# EAGLE design sang_bu (EAGLE 6.0)
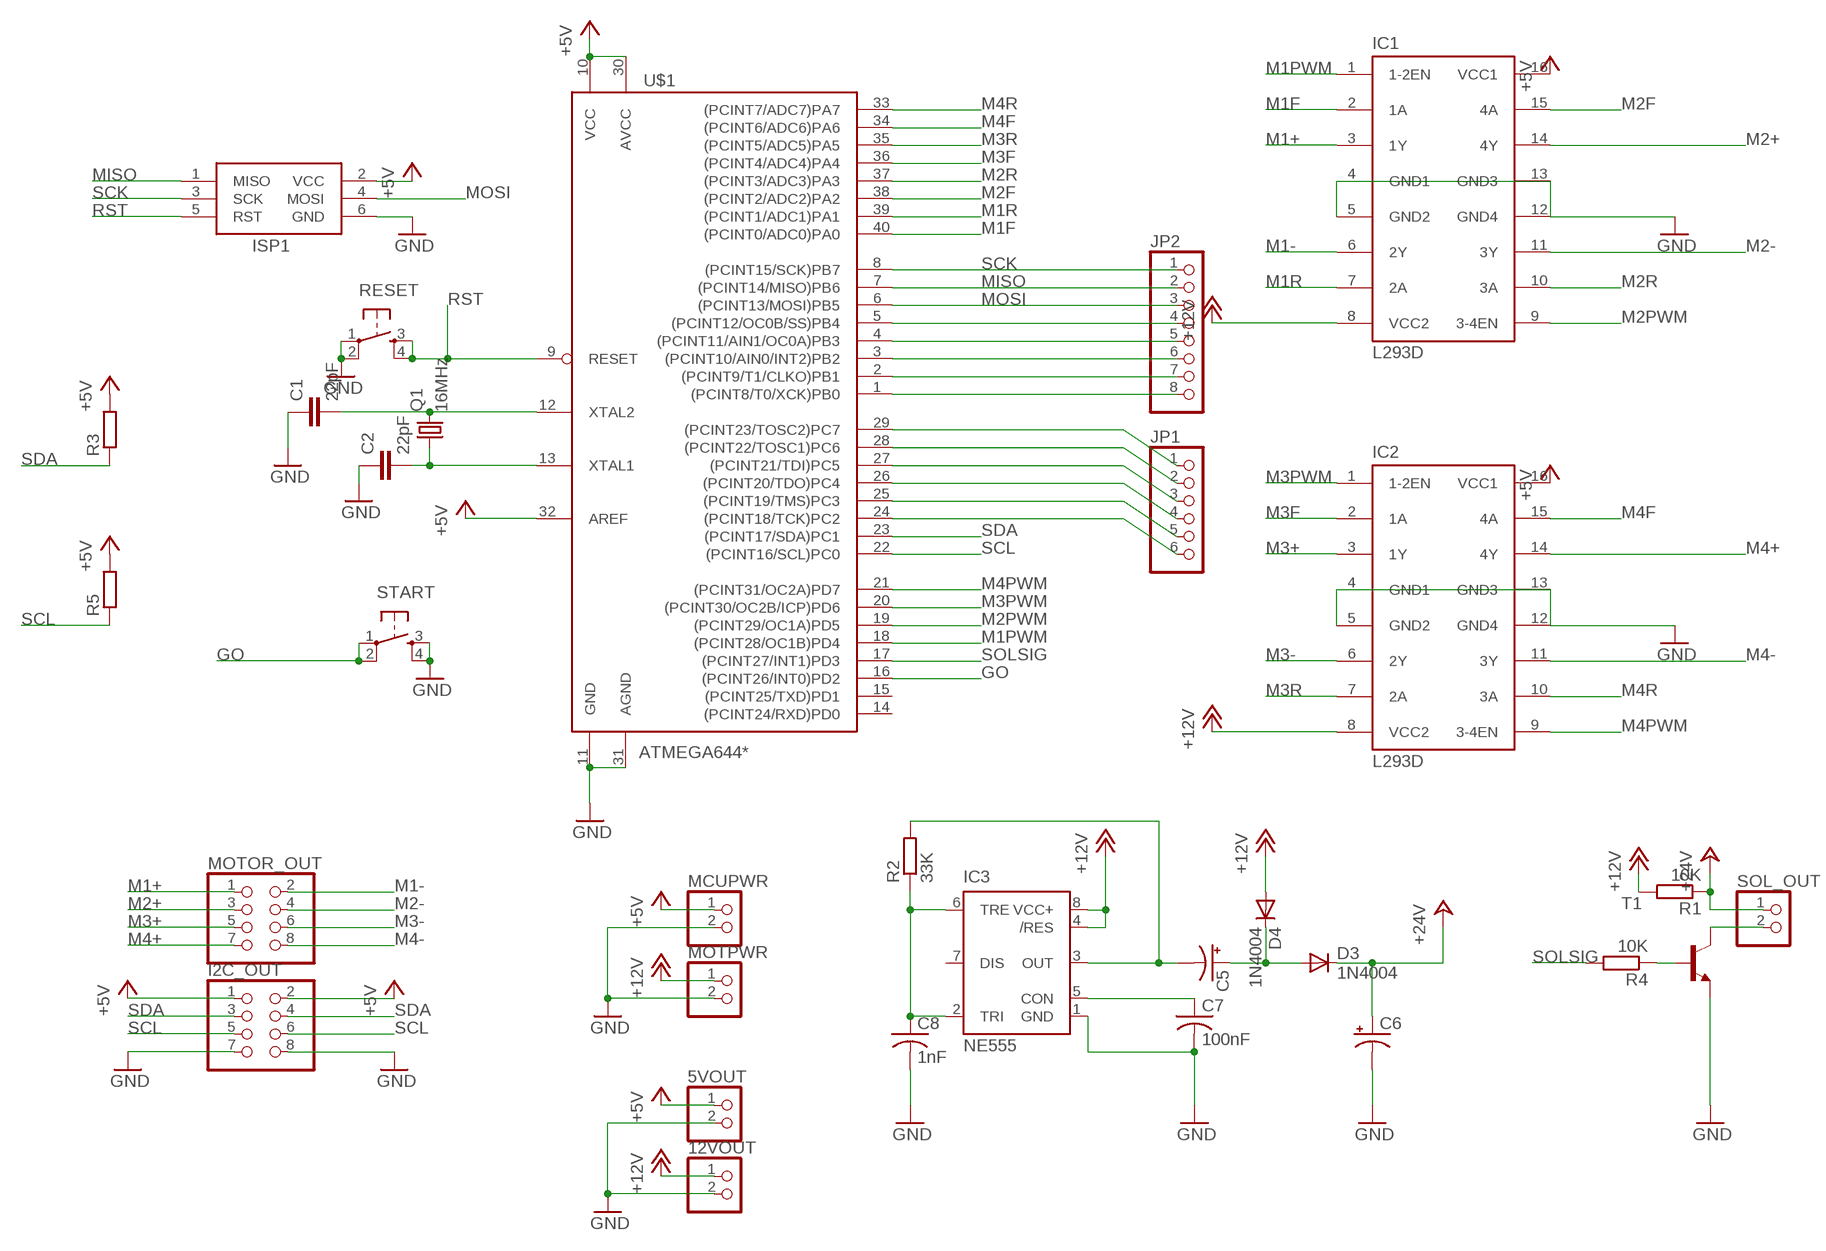
[diagram p0: schematic, sheet 1]

## Parts
5VOUT  PINHD-1X2  [1X02]
12VOUT  PINHD-1X2  [1X02]
C1  22pF  C2.5/2  [C2.5-2]
C2  22pF  C2.5/2  [C2.5-2]
C5  CPOL-USE7.5-18  [E7,5-18]
C6  CPOL-USE7.5-18  [E7,5-18]
C7  100nF  C-US025-030X050  [C025-030X050]
C8  1nF  C-US025-030X050  [C025-030X050]
D3  1N4004  [DO41-10]
D4  1N4004  [DO41-10]
I2C_OUT  PINHD-2X4  [2X04]
IC1  L293D  [DIL16]
IC2  L293D  [DIL16]
IC3  NE555  [DIL-08]
ISP1  AVRISP-6  [AVRISP]
JP1  PINHD-1X6  [1X06]
JP2  PINHD-1X8BIG  [1X08-BIG]
MCUPWR  PINHD-1X2  [1X02]
MOTOR_OUT  PINHD-2X4  [2X04]
MOTPWR  PINHD-1X2  [1X02]
Q1  16MHz  CRYSTALHC49U70  [HC49U70]
R1  10K  R-EU_0207/10  [0207/10]
R2  33K  R-EU_0207/10  [0207/10]
R3  R-EU_0204/7  [0204/7]
R4  10K  R-EU_0207/10  [0207/10]
R5  R-EU_0204/7  [0204/7]
RESET  TAC_SWITCHPTH  [TACTILE-PTH]
SOL_OUT  PINHD-1X2  [1X02]
START  TAC_SWITCHPTH  [TACTILE-PTH]
T1  2N2218-NPN-TO39-EBC  [TO39]
U$1  ATMEGA644*  [ATMEGA644]

## Nets
+5V [LowPow]: 5VOUT.1 I2C_OUT.1 I2C_OUT.2 IC1.16(VCC1) IC2.16(VCC1) ISP1.2(VCC) MCUPWR.1 R3.2 R5.2 U$1.10(VCC) U$1.30(AVCC) U$1.32(AREF)
+12V [HighPow]: 12VOUT.1 D4.A IC1.8(VCC2) IC2.8(VCC2) IC3.4(/RES) IC3.8(VCC+) MOTPWR.1 R1.2
+24V [HighPow]: C6.+ D3.C R1.1 SOL_OUT.1
GND [HighPow]: 5VOUT.2 12VOUT.2 C1.1 C2.1 C6.- C7.2 C8.2 I2C_OUT.7 I2C_OUT.8 IC1.4(GND1) IC1.5(GND2) IC1.12(GND4) IC1.13(GND3) IC2.4(GND1) IC2.5(GND2) IC2.12(GND4) IC2.13(GND3) IC3.1(GND) ISP1.6(GND) MCUPWR.2 MOTPWR.2 RESET.1 RESET.2 START.3 START.4 T1.1(E) U$1.11(GND) U$1.31(AGND)
GO: START.1 START.2 U$1.16((PCINT26/INT0)PD2)
M1+ [HighPow]: IC1.3(1Y) MOTOR_OUT.1
M1- [HighPow]: IC1.6(2Y) MOTOR_OUT.2
M1F: IC1.2(1A) U$1.40((PCINT0/ADC0)PA0)
M1PWM: IC1.1(1-2EN) U$1.18((PCINT28/OC1B)PD4)
M1R: IC1.7(2A) U$1.39((PCINT1/ADC1)PA1)
M2+: IC1.14(4Y) MOTOR_OUT.3
M2- [HighPow]: IC1.11(3Y) MOTOR_OUT.4
M2F: IC1.15(4A) U$1.38((PCINT2/ADC2)PA2)
M2PWM: IC1.9(3-4EN) U$1.19((PCINT29/OC1A)PD5)
M2R: IC1.10(3A) U$1.37((PCINT3/ADC3)PA3)
M3+ [HighPow]: IC2.3(1Y) MOTOR_OUT.5
M3- [HighPow]: IC2.6(2Y) MOTOR_OUT.6
M3F: IC2.2(1A) U$1.36((PCINT4/ADC4)PA4)
M3PWM: IC2.1(1-2EN) U$1.20((PCINT30/OC2B/ICP)PD6)
M3R: IC2.7(2A) U$1.35((PCINT5/ADC5)PA5)
M4+ [HighPow]: IC2.14(4Y) MOTOR_OUT.7
M4- [HighPow]: IC2.11(3Y) MOTOR_OUT.8
M4F: IC2.15(4A) U$1.34((PCINT6/ADC6)PA6)
M4PWM: IC2.9(3-4EN) U$1.21((PCINT31/OC2A)PD7)
M4R: IC2.10(3A) U$1.33((PCINT7/ADC7)PA7)
MISO [LowPow]: ISP1.1(MISO) JP2.2 U$1.7((PCINT14/MISO)PB6)
MOSI [LowPow]: ISP1.4(MOSI) JP2.3 U$1.6((PCINT13/MOSI)PB5)
N$1: C1.2 Q1.2 U$1.12(XTAL2)
N$2: C2.2 Q1.1 U$1.13(XTAL1)
N$3: C8.1 IC3.2(TRI) IC3.6(TRE) R2.1
N$4: R4.1 T1.2(B)
N$5: C5.- IC3.3(OUT) R2.2
N$6 [HighPow]: C5.+ D3.A D4.C
N$7: SOL_OUT.2 T1.3(C)
N$8: JP1.6 U$1.24((PCINT18/TCK)PC2)
N$9: C7.1 IC3.5(CON)
N$10: JP1.5 U$1.25((PCINT19/TMS)PC3)
N$11: JP1.4 U$1.26((PCINT20/TDO)PC4)
N$12: JP1.3 U$1.27((PCINT21/TDI)PC5)
N$13: JP1.2 U$1.28((PCINT22/TOSC1)PC6)
N$14: JP1.1 U$1.29((PCINT23/TOSC2)PC7)
N$15: JP2.8 U$1.1((PCINT8/T0/XCK)PB0)
N$16: JP2.7 U$1.2((PCINT9/T1/CLKO)PB1)
N$17: JP2.6 U$1.3((PCINT10/AIN0/INT2)PB2)
N$18: JP2.5 U$1.4((PCINT11/AIN1/OC0A)PB3)
N$19: JP2.4 U$1.5((PCINT12/OC0B/SS)PB4)
RST [LowPow]: ISP1.5(RST) RESET.3 RESET.4 U$1.9(RESET)
SCK [LowPow]: ISP1.3(SCK) JP2.1 U$1.8((PCINT15/SCK)PB7)
SCL: I2C_OUT.5 I2C_OUT.6 R5.1 U$1.22((PCINT16/SCL)PC0)
SDA: I2C_OUT.3 I2C_OUT.4 R3.1 U$1.23((PCINT17/SDA)PC1)
SOLSIG: R4.2 U$1.17((PCINT27/INT1)PD3)
Unconnected: IC3.7(DIS) U$1.14((PCINT24/RXD)PD0) U$1.15((PCINT25/TXD)PD1)

## Library data of the parts
5VOUT 12VOUT MCUPWR MOTPWR SOL_OUT = pinhead:PINHD-1X2: PIN HEADER
C1 C2 = capacitor-wima:C: CAPACITOR naming: grid - package width
C5 C6 = adafruit:CPOL-US: POLARIZED CAPACITOR, American symbol
C7 C8 = adafruit:C-US: CAPACITOR, American symbol
D3 D4 = adafruit:1N4004: DIODE General purpose 1N400x type rectifier (With bigger pads) http://www.ladyada.net/library/pcb/eaglelibrary.html
I2C_OUT MOTOR_OUT = pinhead:PINHD-2X4: PIN HEADER
IC1 IC2 = st-microelectronics:L293D: PUSH-PULL 4 CHANNEL DRIVER; MPN: L293D; OC_FARNELL: 9589619; OC_NEWARK: 56P8249
IC3 = st-microelectronics:NE555: General purpose bipolar Timer; MF: Arrow Electronics; MPN: NE555N; OC_FARNELL: 1467742; OC_NEWARK: 89K1486
ISP1 = adafruit:AVRISP: AVR ISP HEADER Standard 6 pin header for AVR programming
JP1 = adafruit:PINHD-1X6: PIN HEADER
JP2 = adafruit:PINHD-1X8: PIN HEADER
Q1 = crystal:CRYSTAL: CRYSTAL; OC_FARNELL: unknown; OC_NEWARK: unknown
R1 R3-R5 = resistor:R-EU_: RESISTOR, European symbol
R2 = rcl:R-EU_: RESISTOR, European symbol
RESET START = SparkFun:TAC_SWITCH: Momentary Switch Button commonly used for reset or general input. Spark Fun Electronics SKU : COM-00097
T1 = transistor:*-NPN-: NPN Transistror BF959 corrected 2008.03.06
U$1 = ATMega644:ATMEGA644

## Net classes
0 default: width 0.254 mm, drill 0.254 mm
1 HighPow: width 1.27 mm, drill 1.27 mm
2 LowPow: width 0.254 mm, drill 0.254 mm

## Board
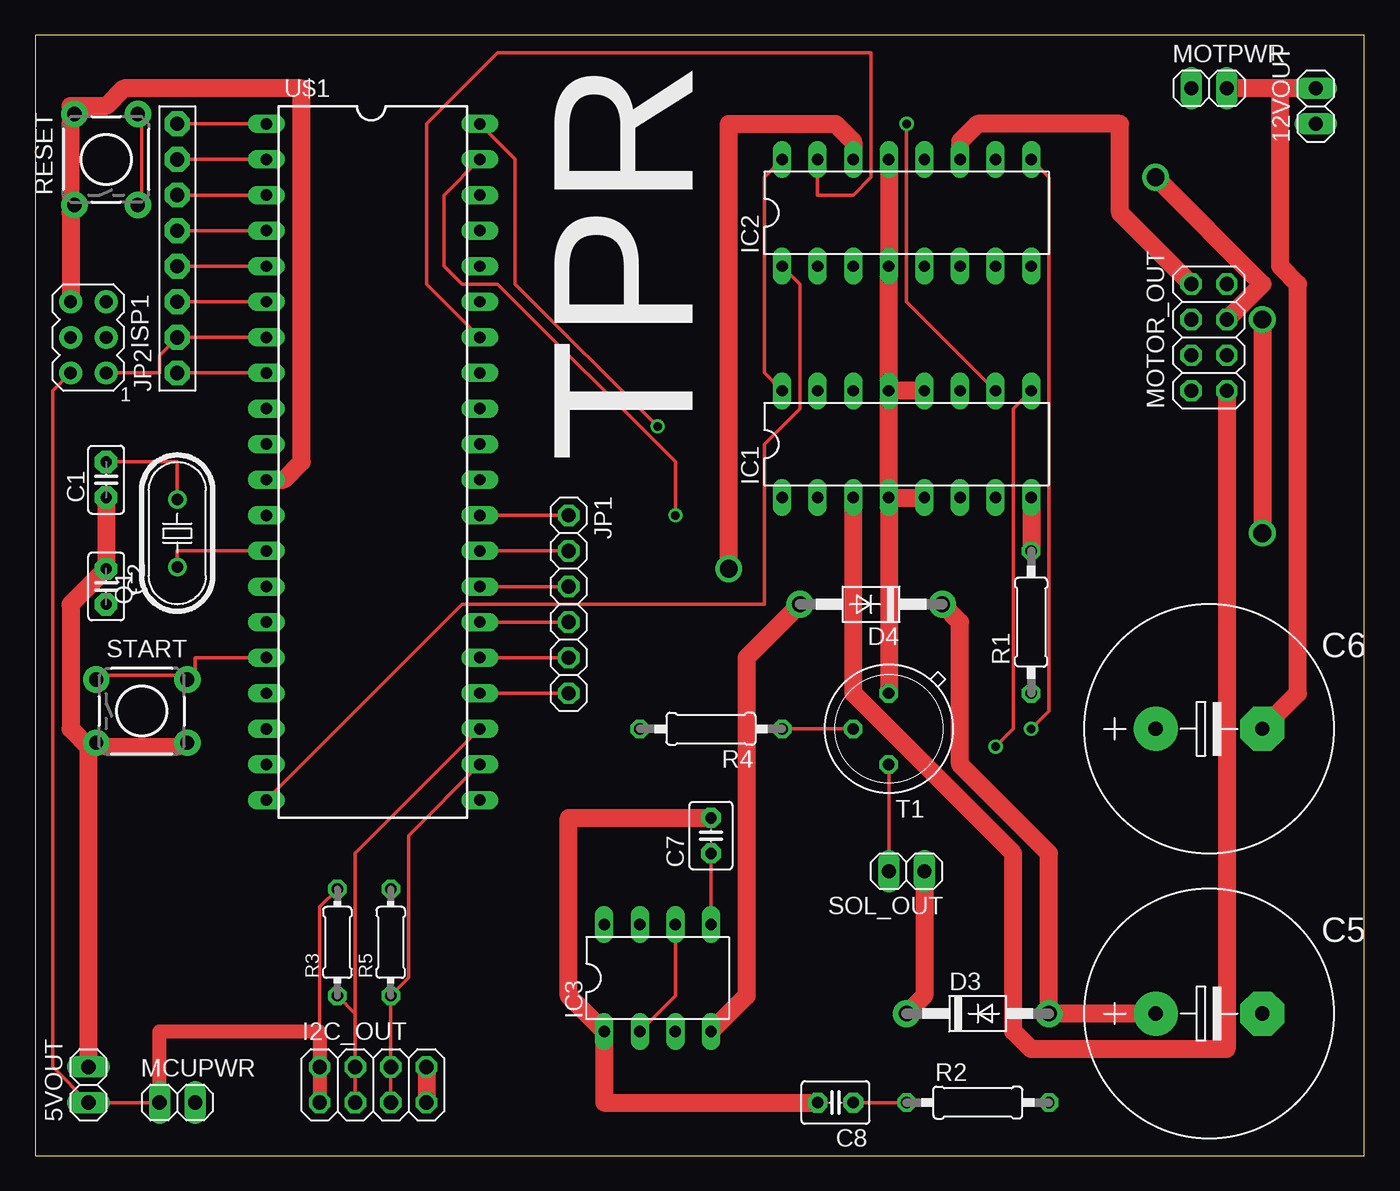
[diagram p1: board, top side]
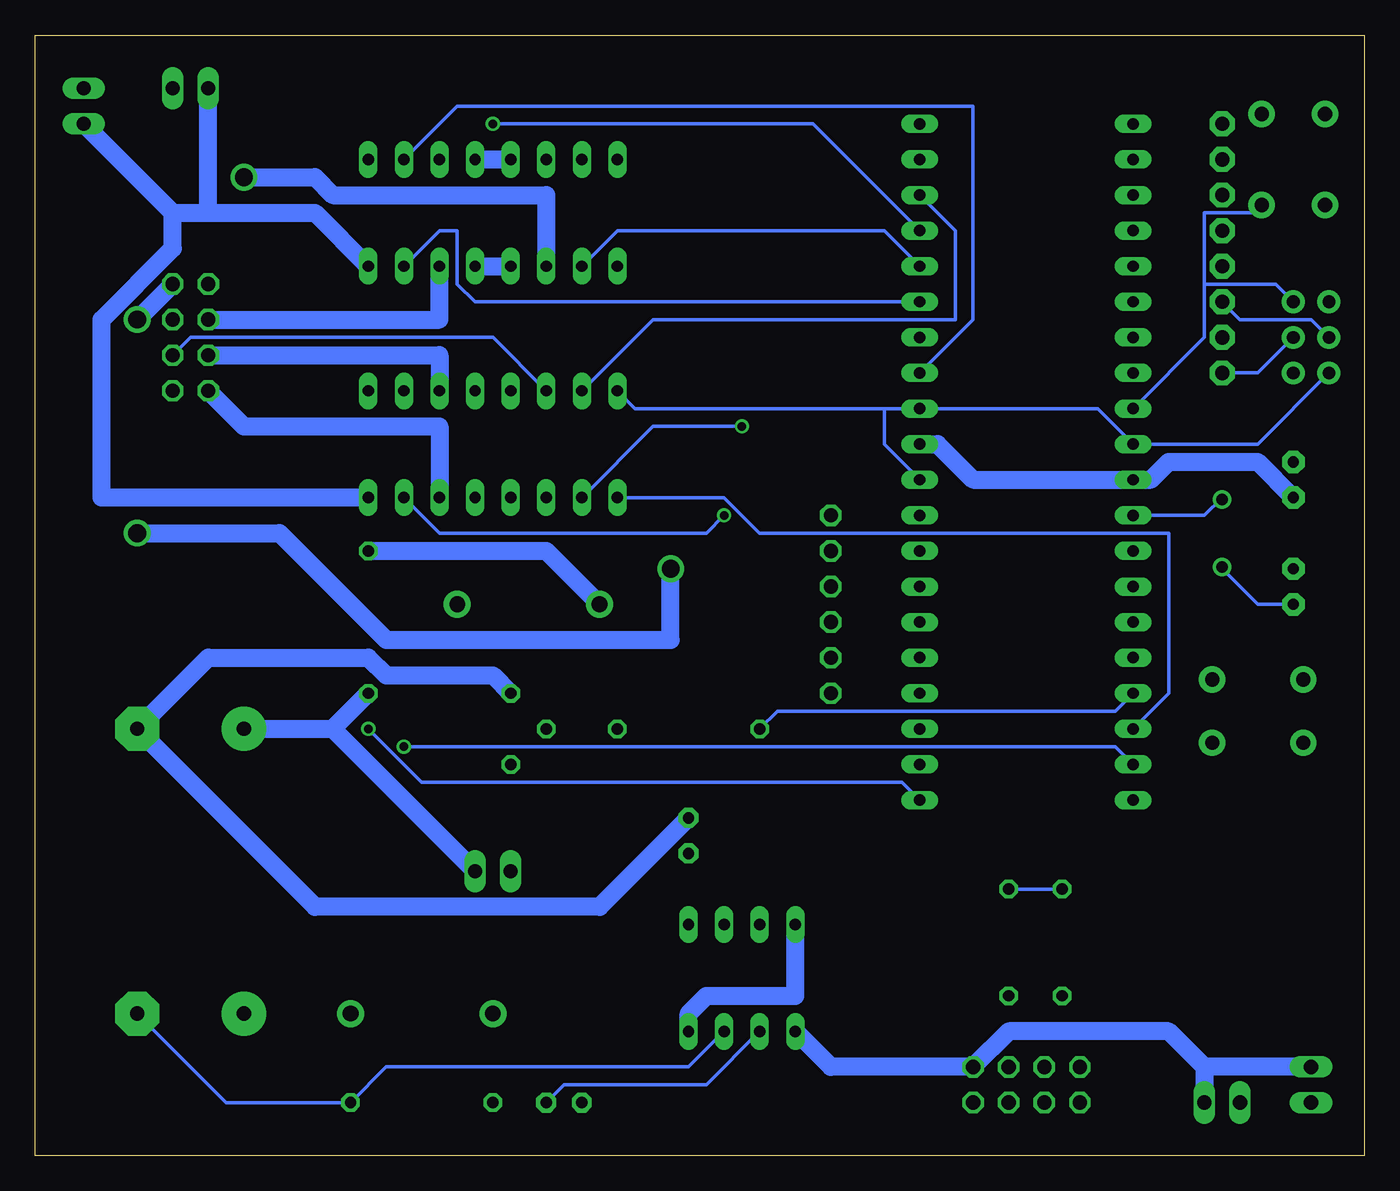
[diagram p2: board, bottom side, seen from below]

Size 94.92 x 80 mm. Coordinates in mm from the lower left corner, seen from the top.
Outline: 0,0 94.92,0 94.92,80 0,80 0,0
Copper layers (1*16): Top 0.035mm / dielectric 1.5mm / Bottom 0.035mm
Design rules: minimum track width 10mil, minimum drill 24mil, track to track 8mil, track to pad 8mil, pad to pad 8mil, via to via 8mil, smd to smd 8mil, copper to edge 40mil, drill to drill 8mil, minimum pad ring 10mil, minimum via ring 8mil, stop-mask expansion 4mil, vias tented up to drill 0mil, thermal gap 10mil

### Footprints (pad centres in the part's own frame; a part is rotated, then mirrored left to right if it is on the bottom)
1X02 = drill 1.016 long: 1 -1.27,0; 2 1.27,0
C2.5-2 = drill 0.813 pad 1.6 octagon: 1 -1.27,0; 2 1.27,0
E7,5-18 = drill 1.016 pad 3.15: + -3.81,0 | drill 1.016 pad 3.15 octagon: - 3.81,0
C025-030X050 = drill 0.813 pad 1.422 octagon: 1 -1.27,0; 2 1.27,0
DO41-10 = drill 1.118 pad 1.93: A 5.08,0; C -5.08,0
2X04 = drill 1.016 octagon: 1 -3.81,-1.27; 2 -3.81,1.27; 3 -1.27,-1.27; 4 -1.27,1.27; 5 1.27,-1.27; 6 1.27,1.27; 7 3.81,-1.27; 8 3.81,1.27
DIL16 = drill 0.813 long: 1 -8.89,-3.81; 2 -6.35,-3.81; 3 -3.81,-3.81; 4 -1.27,-3.81; 5 1.27,-3.81; 6 3.81,-3.81; 7 6.35,-3.81; 8 8.89,-3.81; 9 8.89,3.81; 10 6.35,3.81; 11 3.81,3.81; 12 1.27,3.81; 13 -1.27,3.81; 14 -3.81,3.81; 15 -6.35,3.81; 16 -8.89,3.81
DIL-08 = drill 0.813 long: 1 -3.81,-3.81; 2 -1.27,-3.81; 3 1.27,-3.81; 4 3.81,-3.81; 5 3.81,3.81; 6 1.27,3.81; 7 -1.27,3.81; 8 -3.81,3.81
AVRISP = drill 0.9 pad 1.626: 1 -1.27,2.54; 2 1.27,2.54; 3 -1.27,0; 4 1.27,0; 5 -1.27,-2.54; 6 1.27,-2.54
1X06 = drill 1.016 octagon: 1 -6.35,0; 2 -3.81,0; 3 -1.27,0; 4 1.27,0; 5 3.81,0; 6 6.35,0
1X08-BIG = drill 1.016 pad 1.778 octagon: 1 -8.89,0; 2 -6.35,0; 3 -3.81,0; 4 -1.27,0; 5 1.27,0; 6 3.81,0; 7 6.35,0; 8 8.89,0
HC49U70 = drill 0.813: 1 -2.413,0; 2 2.413,0
0207/10 = drill 0.813 octagon: 1 -5.08,0; 2 5.08,0
0204/7 = drill 0.813 octagon: 1 -3.81,0; 2 3.81,0
TACTILE-PTH = drill 1.016 pad 1.88: 1 -3.251,2.261; 2 3.251,2.261; 3 -3.251,-2.261; 4 3.251,-2.261
TO39 = drill 0.813 octagon: 1 0,-2.54; 2 2.54,0; 3 0,2.54
ATMEGA644 = drill 0.813 long: 1 -22.86,-7.62; 2 -20.32,-7.62; 3 -17.78,-7.62; 4 -15.24,-7.62; 5 -12.7,-7.62; 6 -10.16,-7.62; 7 -7.62,-7.62; 8 -5.08,-7.62; 9 -2.54,-7.62; 10 0,-7.62; 11 2.54,-7.62; 12 5.08,-7.62; 13 7.62,-7.62; 14 10.16,-7.62; 15 12.7,-7.62; 16 15.24,-7.62; 17 17.78,-7.62; 18 20.32,-7.62; 19 22.86,-7.62; 20 25.4,-7.62; 21 25.4,7.62; 22 22.86,7.62; 23 20.32,7.62; 24 17.78,7.62; 25 15.24,7.62; 26 12.7,7.62; 27 10.16,7.62; 28 7.62,7.62; 29 5.08,7.62; 30 2.54,7.62; 31 0,7.62; 32 -2.54,7.62; 33 -5.08,7.62; 34 -7.62,7.62; 35 -10.16,7.62; 36 -12.7,7.62; 37 -15.24,7.62; 38 -17.78,7.62; 39 -20.32,7.62; 40 -22.86,7.62

### Placement (x,y rotation side)
5VOUT  3.81,5.08 90 top
12VOUT  91.44,74.93 90 top
C1  5.08,48.26 90 top
C2  5.08,40.64 270 top
C5  83.82,10.16 0 top
C6  83.82,30.48 0 top
C7  48.26,22.86 90 top
C8  57.15,3.81 180 top
D3  67.31,10.16 0 top
D4  59.69,39.37 180 top
I2C_OUT  24.13,5.08 0 top
IC1  62.23,50.8 0 top
IC2  62.23,67.31 0 top
IC3  44.45,12.7 0 top
ISP1  3.81,58.42 180 top
JP1  38.1,39.37 270 top
JP2  10.16,64.77 90 top
MCUPWR  10.16,3.81 0 top
MOTOR_OUT  83.82,58.42 90 top
MOTPWR  83.82,76.2 0 top
Q1  10.16,44.45 90 top
R1  71.12,38.1 90 top
R2  67.31,3.81 0 top
R3  21.59,15.24 90 top
R4  48.26,30.48 180 top
R5  25.4,15.24 90 top
RESET  5.08,71.12 90 top
SOL_OUT  62.23,20.32 180 top
START  7.62,31.75 0 top
T1  60.96,30.48 180 top
U$1  24.13,50.8 270 top

### Tracks (layer width: path | path; a pad name or v marks a point on that pad's centre or on a via)
+5V
  Top 0.254: MCUPWR.1 5VOUT.1 1.27,6.35 1.27,54.61 ISP1.2 | R3.2 20.32,17.78 I2C_OUT.2 | IC2.16 52.07,69.85 52.07,55.88 IC1.16
  Top 1.016: MCUPWR.1 8.89,8.89 20.32,8.89 I2C_OUT.2 I2C_OUT.1
  Bottom 0.254: R5.2 R3.2 | U$1.30 34.29,50.8 34.29,53.34 | 34.29,53.34 U$1.32 19.05,53.34 U$1.10 7.62,50.8 ISP1.2 | IC1.16 52.07,53.34 34.29,53.34
+12V
  Top 1.27: IC1.8 R1.2 | IC3.4 50.8,11.43 50.8,35.56 D4.A
  Bottom 1.27: IC2.8 74.93,67.31 82.55,67.31 | 85.09,67.31 82.55,67.31 | 12VOUT.1 85.09,67.31 | 82.55,67.31 MOTPWR.1 | IC3.8 40.64,11.43 46.99,11.43 48.26,10.16 IC3.4 | D4.A 58.42,43.18 R1.2 | 85.09,67.31 85.09,64.77 90.17,59.69 90.17,46.99 IC1.8
+24V
  Top 1.27: D3.C 63.5,11.43 SOL_OUT.1
  Bottom 1.27: 73.66,30.48 R1.1 | C6.+ 73.66,30.48 | 73.66,30.48 SOL_OUT.1
GND
  Top 1.27: IC2.13 IC2.4 IC1.13 | IC1.12 IC1.13 | IC1.4 T1.1 | IC1.4 IC1.5 | IC1.4 IC1.13 | 12VOUT.2 88.9,76.2 | 88.9,76.2 MOTPWR.2 | 88.9,76.2 88.9,63.5 90.17,62.23 90.17,33.02 C6.- | C7.2 38.1,24.13 38.1,11.43 IC3.1 40.64,3.81 C8.2 | I2C_OUT.8 I2C_OUT.7 | 3.81,29.21 5VOUT.2 | START.4 10.16,29.21 5.08,29.21 START.3 3.81,29.21 | ISP1.6 2.54,67.31 RESET.1 2.54,68.58 2.54,73.66 RESET.2 2.54,74.93 5.08,74.93 6.35,76.2 19.05,76.2 19.05,49.53 17.78,48.26 U$1.11 | C1.1 C2.1 2.54,39.37 2.54,30.48 3.81,29.21
  Bottom 1.27: IC2.5 IC2.4 | IC2.12 IC2.13 | T1.1 62.23,34.29 69.85,34.29 71.12,35.56 82.55,35.56 C6.- 74.93,17.78 54.61,17.78 C7.2 | IC3.1 38.1,6.35 I2C_OUT.8 25.4,8.89 13.97,8.89 11.43,6.35 | 11.43,6.35 MCUPWR.2 | 5VOUT.2 11.43,6.35 | U$1.31 30.48,50.8 27.94,48.26 U$1.11 15.24,48.26 13.97,49.53 7.62,49.53 C1.1
GO
  Top 0.254: U$1.16 11.43,35.56 11.43,34.29 START.2 10.16,34.29 5.08,34.29 START.1
M1+
  Top 1.27: IC1.3 58.42,33.02 69.85,21.59 69.85,8.89 71.12,7.62 85.09,7.62 MOTOR_OUT.1
M1-
  Bottom 1.27: IC1.6 66.04,52.07 80.01,52.07 MOTOR_OUT.2
M1F  (via drill 0.61)
  Top 0.254: v44.45,52.07 34.29,62.23 34.29,71.12 U$1.40
  Bottom 0.254: IC1.2 50.8,52.07 v44.45,52.07
M1PWM
  Bottom 0.254: U$1.18 13.97,33.02 13.97,44.45 43.18,44.45 45.72,46.99 IC1.1
M1R  (via drill 0.61)
  Top 0.254: U$1.39 29.21,68.58 29.21,63.5 30.48,62.23 33.02,62.23 45.72,49.53 v45.72,45.72
  Bottom 0.254: v45.72,45.72 46.99,44.45 66.04,44.45 IC1.7
M2+
  Bottom 0.254: IC1.14 62.23,58.42 83.82,58.42 MOTOR_OUT.3
M2-
  Bottom 1.27: IC1.11 66.04,57.15 MOTOR_OUT.4
M2F
  Bottom 0.254: U$1.38 29.21,66.04 29.21,59.69 50.8,59.69 IC1.15
M2PWM  (via drill 0.61)
  Top 0.254: v68.58,29.21 69.85,30.48 69.85,53.34 IC1.9
  Bottom 0.254: U$1.19 17.78,29.21 v68.58,29.21
M2R  (via drill 0.61)
  Top 0.254: IC1.10 62.23,60.96 v62.23,73.66
  Bottom 0.254: v62.23,73.66 39.37,73.66 U$1.37
M3+  (via drill 1.27)
  Top 1.27: v80.01,69.85 87.63,62.23 MOTOR_OUT.5
  Bottom 1.27: IC2.3 58.42,68.58 73.66,68.58 74.93,69.85 v80.01,69.85
M3-
  Bottom 1.27: IC2.6 66.04,59.69 MOTOR_OUT.6
M3F
  Bottom 0.254: U$1.36 34.29,66.04 53.34,66.04 IC2.2
M3PWM
  Top 0.254: U$1.20 30.48,39.37 52.07,39.37 52.07,50.8 54.61,53.34 54.61,62.23 IC2.1
M3R
  Bottom 0.254: U$1.35 63.5,60.96 64.77,62.23 64.77,66.04 66.04,66.04 IC2.7
M4+  (via drill 1.27)
  Top 1.27: IC2.14 58.42,72.39 57.15,73.66 49.53,73.66 v49.53,41.91 | v87.63,59.69 v87.63,44.45
  Bottom 1.27: v49.53,41.91 49.53,36.83 69.85,36.83 77.47,44.45 v87.63,44.45 | MOTOR_OUT.7 v87.63,59.69
M4-
  Top 1.27: IC2.11 66.04,72.39 67.31,73.66 77.47,73.66 77.47,67.31 MOTOR_OUT.8
M4F
  Top 0.254: U$1.34 27.94,62.23 27.94,73.66 33.02,78.74 59.69,78.74 59.69,69.85 58.42,68.58 55.88,68.58 IC2.15
M4PWM  (via drill 0.61)
  Top 0.254: v71.12,30.48 72.39,31.75 72.39,69.85 IC2.9
  Bottom 0.254: U$1.21 33.02,26.67 67.31,26.67 v71.12,30.48
M4R
  Bottom 0.254: U$1.33 27.94,59.69 27.94,74.93 64.77,74.93 IC2.10
MISO
  Top 0.254: U$1.7 JP2.2 8.89,57.15 8.89,55.88 ISP1.1
MOSI
  Top 0.254: JP2.3 U$1.6
  Bottom 0.254: ISP1.4 3.81,59.69 8.89,59.69 JP2.3
N$1
  Top 0.254: C1.2 10.16,49.53 Q1.2
  Bottom 0.254: U$1.12 11.43,45.72 10.16,46.99 Q1.2
N$2
  Top 0.254: U$1.13 10.16,43.18 Q1.1 10.16,41.91
  Bottom 0.254: C2.2 7.62,39.37 10.16,41.91 Q1.1
N$3
  Top 0.254: C8.1 R2.1 | IC3.2 45.72,11.43 IC3.6
  Bottom 0.254: C8.1 57.15,5.08 46.99,5.08 IC3.2
N$4
  Top 0.254: T1.2 R4.1
N$5
  Bottom 0.254: IC3.3 48.26,6.35 69.85,6.35 R2.2 81.28,3.81 C5.-
N$6
  Top 1.27: C5.+ D3.A 72.39,21.59 66.04,27.94 66.04,38.1 D4.C
N$7
  Top 0.254: SOL_OUT.2 T1.3
N$8
  Top 0.254: JP1.6 U$1.24
N$9
  Top 0.254: C7.1 IC3.5
N$10
  Top 0.254: JP1.5 U$1.25
N$11
  Top 0.254: JP1.4 U$1.26
N$12
  Top 0.254: JP1.3 U$1.27
N$13
  Top 0.254: JP1.2 U$1.28
N$14
  Top 0.254: JP1.1 U$1.29
N$15
  Top 0.254: JP2.8 U$1.1
N$16
  Top 0.254: JP2.7 U$1.2
N$17
  Top 0.254: JP2.6 U$1.3
N$18
  Top 0.254: JP2.5 U$1.4
N$19
  Top 0.254: JP2.4 U$1.5
RST
  Top 0.254: RESET.4 7.62,73.66 7.62,68.58 RESET.3
  Bottom 0.254: U$1.9 11.43,58.42 11.43,62.23 | 11.43,62.23 11.43,67.31 7.62,67.31 RESET.3 | ISP1.5 6.35,62.23 11.43,62.23
SCK
  Top 0.254: JP2.1 U$1.8
  Bottom 0.254: ISP1.3 7.62,55.88 JP2.1
SCL
  Top 0.254: U$1.22 26.67,22.86 26.67,12.7 R5.1 I2C_OUT.6 I2C_OUT.5
SDA
  Top 0.254: 22.86,10.16 R3.1 | 22.86,10.16 I2C_OUT.4 I2C_OUT.3 | U$1.23 22.86,21.59 22.86,10.16
SOLSIG
  Bottom 0.254: U$1.17 17.78,31.75 41.91,31.75 R4.2

### Text on the board
tPlace: TPR